# Altium project Universal_Analog_Input.PrjPcb (part 2 of 2)

## Sheet [03] - Power.SchDoc
size A2; DocumentNumber: 5; SheetNumber: 5; SheetTotal: 5
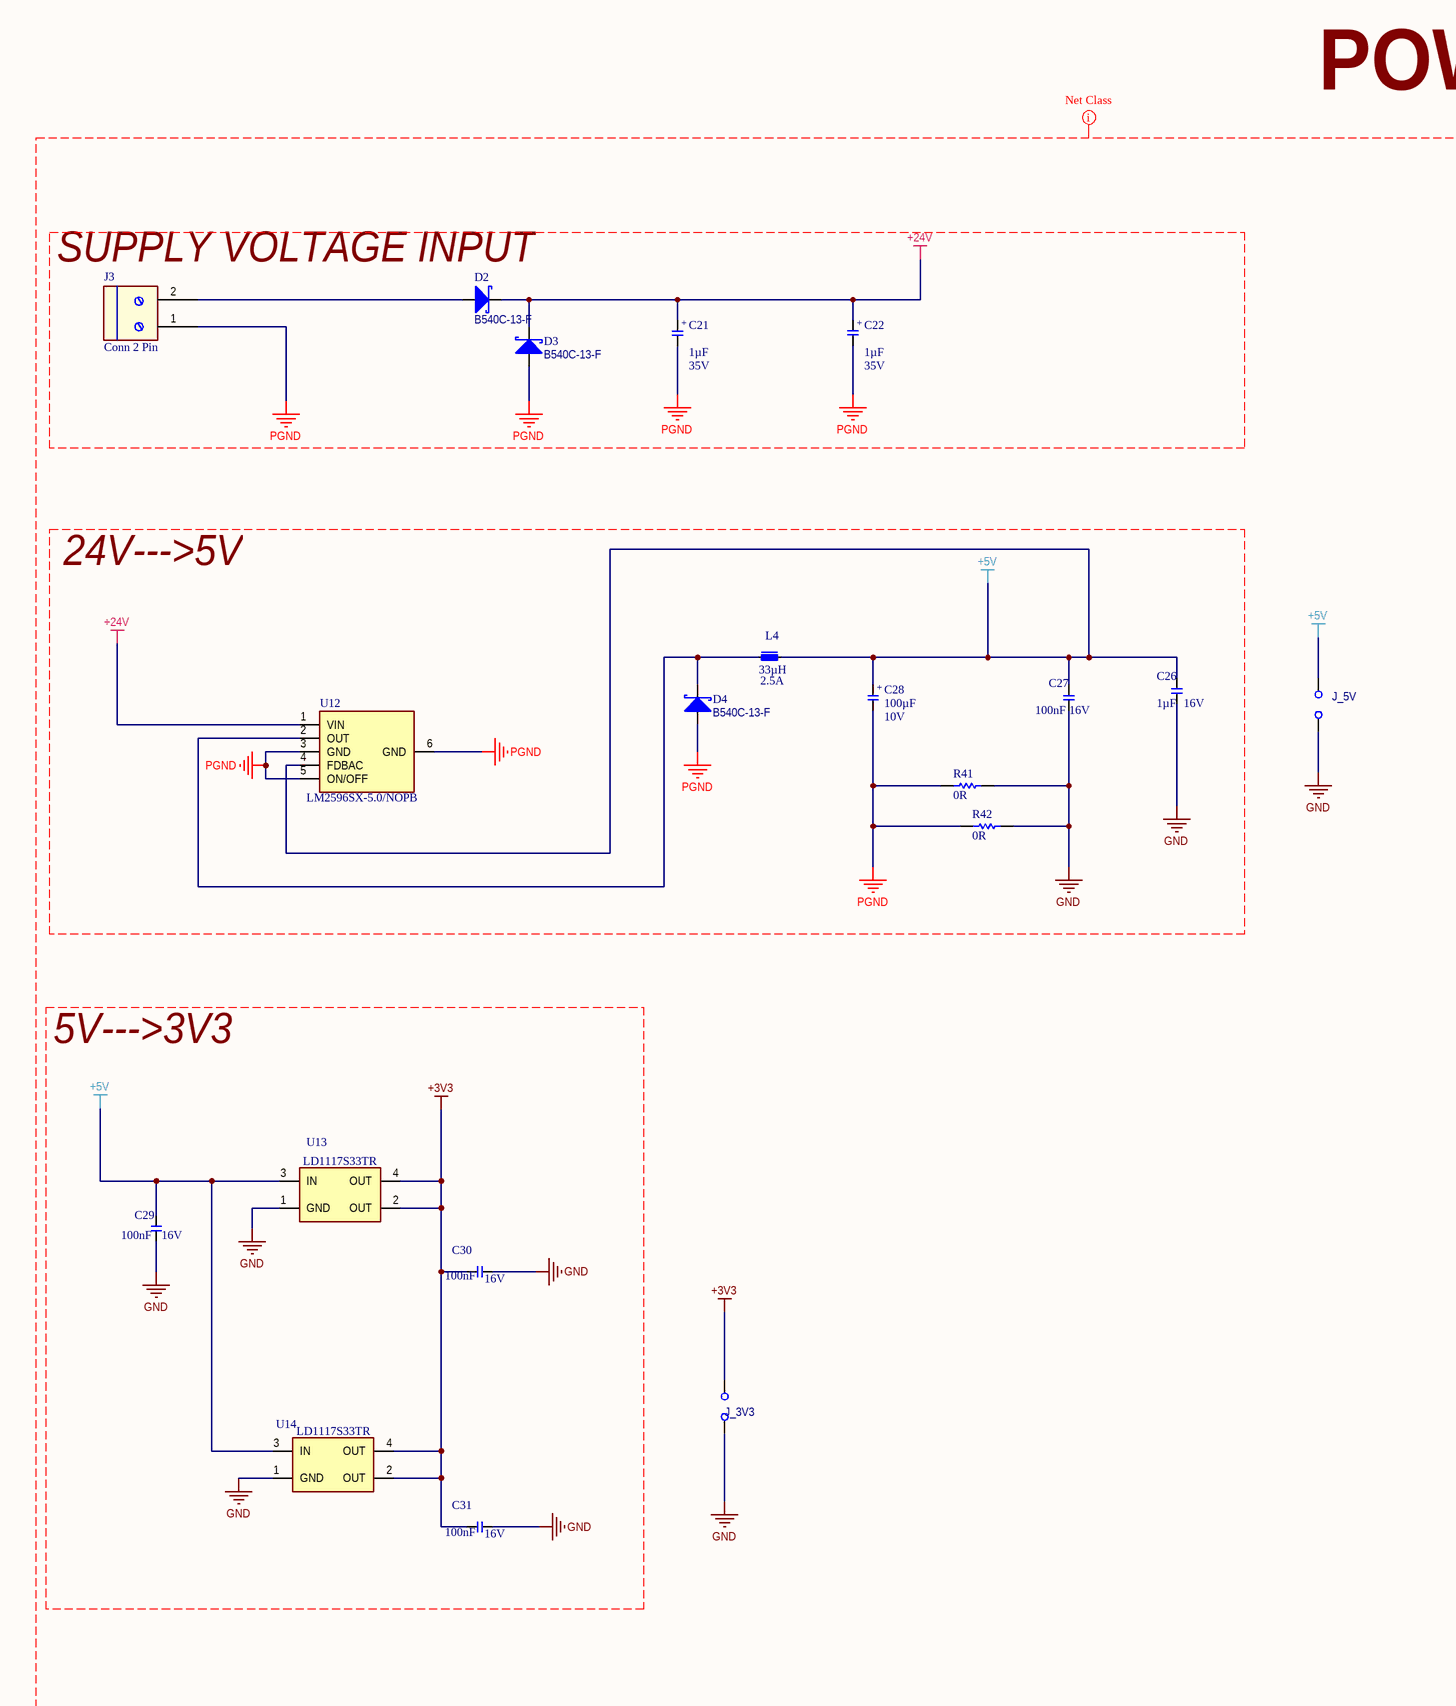
[diagram p6: [03] - Power.SchDoc, left]
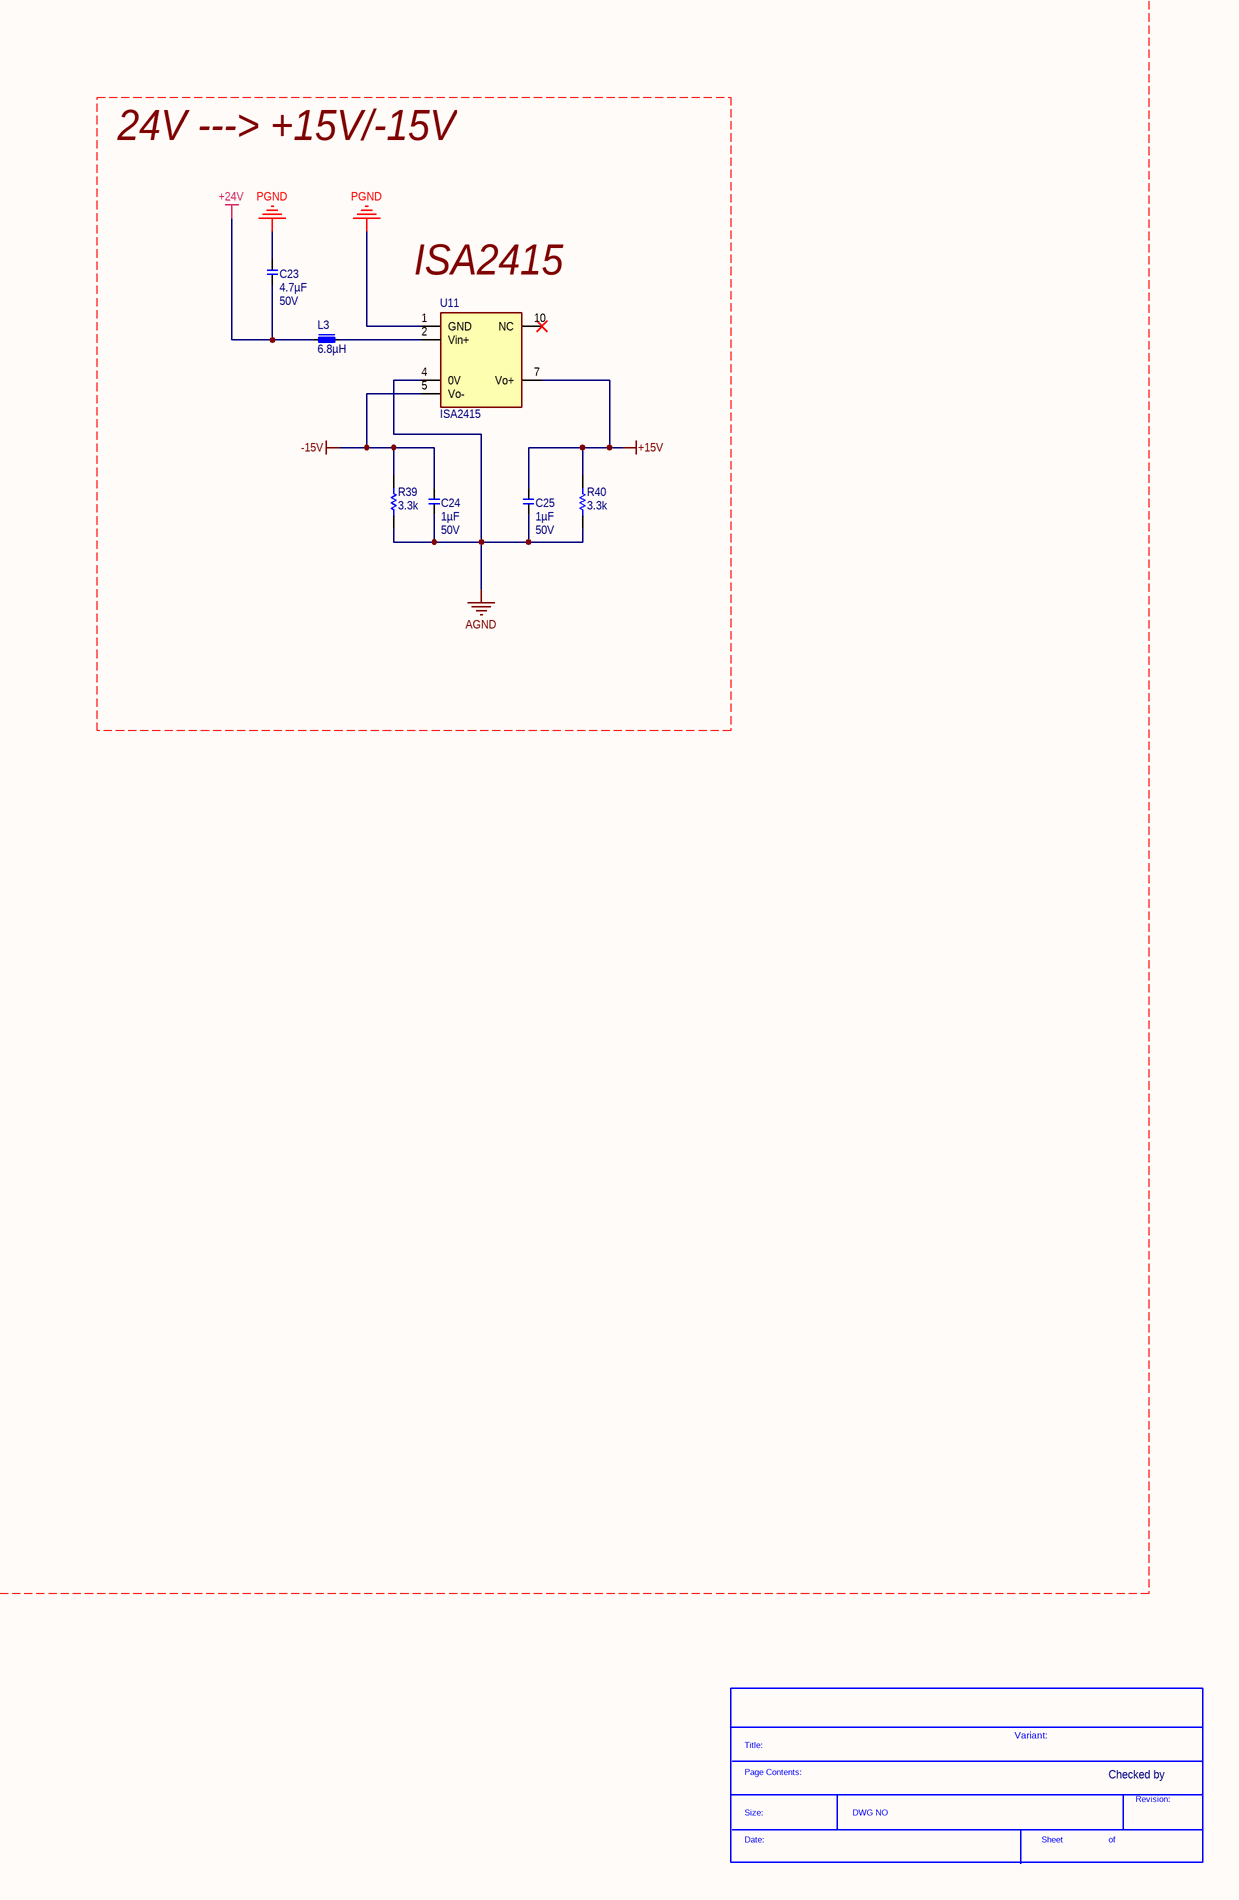
[diagram p7: [03] - Power.SchDoc, right]

### Parts
(Parts that share a designator on the sheet are numbered #1, #2 ... from top to bottom, then left to right.)
*?#3  SDTitleBlock  (value not drawn)  (graphical)
C21  Capacitance: 1µF  Voltage - Rated: 35V  [Case_A]  (hidden comment: CAP TANT 1UF 35V 10% 1206)
C22  Capacitance: 1µF  Voltage - Rated: 35V  [Case_A]  (hidden comment: CAP TANT 1UF 35V 10% 1206)
C23  Capacitance: 4.7µF  Voltage - Rated: 50V  [C1206]  (hidden comment: 4.7UF 50V X7R)
C24  Capacitance: 1µF  Voltage - Rated: 50V  [C0805]  (hidden comment: 1UF 50V X7R)
C25  Capacitance: 1µF  Voltage - Rated: 50V  [C0805]  (hidden comment: 1UF 50V X7R)
C26  1µF  Voltage - Rated: 16V  [C0805]
C27  100nF  Voltage - Rated: 16V  [C0805]
C28  Voltage - Rated: 10V  [Case_C]  (hidden comment: 100µF)
C29  100nF  Voltage - Rated: 16V  [C0805]
C30  100nF  Voltage - Rated: 16V  [C0805]
C31  100nF  Voltage - Rated: 16V  [C0805]
D2  B540C-13-F  [B520C-13-F]
D3  B540C-13-F  [B520C-13-F]
D4  B540C-13-F  [B520C-13-F]
J3  Conn 2 Pin  [Connector 2 Ways Pitch 3,81]
J_3V3  PH1-02-TA-HT  [HDR1X2V]  (value not drawn)
J_5V  PH1-02-TA-HT  [HDR1X2V]  (value not drawn)
L3  Inductance: 6.8µH  [0805]  (hidden comment: 6.8UH 550MA)
L4  Inductance: 33µH  Current Rating: 2.5A  [Bobin_SMD]  (hidden comment: L-IND 33UH 2.5A)
R39  Resistance (Ohms): 3.3k  [R0805]  (hidden comment: 3.3K OHM 0805)
R40  Resistance (Ohms): 3.3k  [R0805]  (hidden comment: 3.3K OHM 0805)
R41  0R  [R0805]
R42  0R  [R0805]
U11  DC/DC CONV  [ISA2415]  (value not drawn)
U12  Manufacturer Part Number: LM2596SX-5.0/NOPB  [TO-263-5]  (hidden comment: IC-LM2596SX-5.0/NOPB)
U13  Manufacturer Part Number: LD1117S33TR  [SOT-223_L]  (hidden comment: IC-LD1117S33TR)
U14  Manufacturer Part Number: LD1117S33TR  [SOT-223_L]  (hidden comment: IC-LD1117S33TR)

### Nets
+3V3: C30.2 C31.2 J_3V3.2 U13.2(OUT) U13.4(OUT) U14.2(OUT) U14.4(OUT)
+5V: C26.2 C27.2 C28.1 C29.2 J_5V.2 L4.2 U12.4(FDBAC) U13.3(IN) U14.3(IN)
+15V: C25.2 R40.2 U11.7(Vo+)
+24V: C21.1 C22.1 C23.1 D2.1 D3.1 L3.1 U12.1(VIN)
-15V: C24.2 R39.2 U11.5(Vo-)
AGND: C24.1 C25.1 R39.1 R40.1 U11.4(0V)
GND: C26.1 C27.1 C29.1 C30.1 C31.1 J_3V3.1 J_5V.1 R41.2 R42.2 U13.1(GND) U14.1(GND)
PGND: C21.2 C22.2 C23.2 C28.2 D3.2 D4.2 J3.1 R41.1 R42.1 U11.1(GND) U12.3(GND) U12.5(ON/OFF) U12.6(GND)
NetD2_2: D2.2 J3.2
NetD4_1: D4.1 L4.1 U12.2(OUT)
NetL3_2: L3.2 U11.2(Vin+)

Not connected (* = marked no-connect by the designer): U11 10(NC)*

### Layout directives
net class POWER: +3V3, +5V, +15V, +24V, -15V, AGND, GND, PGND

### Notes on the sheet
- POWER
- SUPPLY VOLTAGE INPUT
- 24V ---> +15V/-15V
- (near U11) ISA2415
- 24V--->5V
- 5V--->3V3
- Variant:
- Checked by
- (in symbol C-10UF,TANTAL C) +
- (in symbol C-T491A105K035AT) +
- (in symbol SDTitleBlock) Title:; Page Contents:; Revision:; Size:; DWG NO; Date:; Sheet; of

### Library data of the parts
C21 C22 = C-T491A105K035AT: Manufacturer: Kemet; Manufacturer Size Code: A; ESR (Equivalent Series Resistance): 7 Ohm; Type: Molded; Lifetime @ Temp.: 2000 Hrs @ 85°C; Supplier 1: Digi-Key; Manufacturer Part Number: T491A105K035AT; RoHS: RoHS Compliant; Pricing 1: 1=0.4, 10=0.354, 50=0.2146, 100=0.1768, 250=0.1414, 500=0.12878, 1000=0.11615 (USD); ComponentLink1URL: http://www.kemet.com/Lists/ProductCatalog/Attachments/254/KEM_T2005_T491.pdf; ComponentLink1Description: http://www.kemet.com/Lists/ProductCatalog/Attachments/254/KEM_T2005_T491.pdf; Category: Capacitors; Stock 1: 10565; Packaging: Cut Tape (CT); Tolerance: ±10%; Operating Temperature: -55°C ~ 125°C; Mounting Type: Surface Mount; Package / Case: 1206 (3216 Metric); Size / Dimension: 0.126" L x 0.063" W (3.20mm x 1.60mm); Height - Seated (Max): 0.071" (1.80mm); Lead Spacing: -; Features: General Purpose
C23 = C-4.7UF,50V,1206: CAP CER 4.7UF 50V X7R 1206; Manufacturer: Samsung Electro-Mechanics America, Inc.; Manufacturer Part Number: CL31B475KBHNNNE; Tolerance: ±10%; Supplier 1: Digi-Key; RoHS: RoHS Compliant; Category: Capacitors; Stock 1: 128633; Pricing 1: 1=0.34, 10=0.28, 25=0.1928, 50=0.1576, 100=0.1401, 500=0.0928, 1000=0.0823 (USD); Packaging: Digi-Reel®; Temperature Coefficient: X7R; Mounting Type: Surface Mount, MLCC; Operating Temperature: -55°C ~ 125°C; Applications: General Purpose; Ratings: -; Package / Case: 1206 (3216 Metric); Size / Dimension: 0.126" L x 0.063" W (3.20mm x 1.60mm); Height - Seated (Max): -; Thickness (Max): 0.071" (1.80mm); Lead Spacing: -; Features: -; Lead Style: -; ComponentLink1URL: http://www.samsungsem.com/kr/support/product-search/mlcc/CL31B475KBHNNNE.jsp; ComponentLink1Description: http://www.samsungsem.com/kr/support/product-search/mlcc/CL31B475KBHNNNE.jsp; Supplier Part Number 1: 1276-2789-6-ND
C24 C25 = C-1UF,50V: CAP CER 1UF 50V X7R 0805; Manufacturer: Samsung Electro-Mechanics America, Inc.; Manufacturer Part Number: CL21B105KBFNNNE; Tolerance: ±10%; Supplier 1: Digi-Key; RoHS: RoHS Compliant; Category: Capacitors; Stock 1: 162738; Pricing 1: 1=0.21, 10=0.143, 25=0.104, 50=0.0866, 100=0.0727, 500=0.05194, 1000=0.04414 (USD); Packaging: Digi-Reel®; Temperature Coefficient: X7R; Mounting Type: Surface Mount, MLCC; Operating Temperature: -55°C ~ 125°C; Applications: General Purpose; Ratings: -; Package / Case: 0805 (2012 Metric); Size / Dimension: 0.079" L x 0.049" W (2.00mm x 1.25mm); Height - Seated (Max): -; Thickness (Max): 0.053" (1.35mm); Lead Spacing: -; Features: -; Lead Style: -; ComponentLink1URL: http://www.samsungsem.com/kr/support/product-search/mlcc/CL21B105KBFNNNE.jsp; ComponentLink1Description: http://www.samsungsem.com/kr/support/product-search/mlcc/CL21B105KBFNNNE.jsp; Supplier Part Number 1: 1276-1029-6-ND
C26 = C-1UF,16V,0805: AVX - 0805YC105KAT2A - CAP, MLCC, X7R, 1UF, 16V, 0805; Manufacturer: AVX Corporation; Tolerance: ±10%; Supplier 1: Digi-Key; Manufacturer Part Number: 0805YC105KAT2A; RoHS: RoHS Compliant; Stock 1: 76930; Pricing 1: 1=0.19, 10=0.132, 25=0.0964, 50=0.075, 100=0.0622, 250=0.05148, 500=0.04362, 1000=0.03611 (USD); Capacitance: 1µF; Packaging: Cut Tape (CT); ComponentLink1URL: http://datasheets.avx.com/X7RDielectric.pdf; ComponentLink1Description: http://datasheets.avx.com/X7RDielectric.pdf; Supplier Part Number 1: 478-5034-1-ND; Category: Capacitors; Temperature Coefficient: X7R; Mounting Type: Surface Mount, MLCC; Operating Temperature: -55°C ~ 125°C; Applications: General Purpose; Ratings: -; Package / Case: 0805 (2012 Metric); Size / Dimension: 0.079" L x 0.049" W (2.01mm x 1.25mm); Height - Seated (Max): -; Thickness (Max): 0.055" (1.40mm); Lead Spacing: -; Features: -; Lead Style: -
C27 C29-C31 = C-100NF,16V,0805: AVX - 0805YA103JAT2A - CAP, MLCC, C0G/NP0, 10NF, 16V, 0805; Tolerance: ±5%; Temperature Coefficient: C0G, NP0; Supplier 1: Digi-Key; Manufacturer: AVX; Manufacturer Part Number: 0805YA103JAT2A; RoHS: YES; Stock 1: 28062; Pricing 1: 1=0.29, 10=0.204, 25=0.1668, 50=0.1424, 100=0.1221, 250=0.10176, 500=0.09158, 1000=0.07733 (USD); Capacitance: 100nF; Packaging: Cut Tape (CT); ComponentLink1URL: http://www.avx.com/docs/Catalogs/ccog.pdf; ComponentLink1Description: http://www.avx.com/docs/Catalogs/ccog.pdf; Supplier Part Number 1: 478-1334-1-ND; ComponentLink2URL: http://www.farnell.com/datasheets/1825494.pdf; ComponentLink2Description: http://www.farnell.com/datasheets/1825494.pdf; Category: Capacitors; Mounting Type: Surface Mount, MLCC; Operating Temperature: -55°C ~ 125°C; Applications: General Purpose; Ratings: -; Package / Case: 0805 (2012 Metric); Size / Dimension: 0.079" L x 0.049" W (2.01mm x 1.25mm); Height - Seated (Max): -; Thickness (Max): 0.037" (0.94mm); Lead Spacing: -; Features: -; Lead Style: -; ComponentLink3URL: http://datasheets.avx.com/C0GNP0-Dielectric.pdf; ComponentLink3Description: http://datasheets.avx.com/C0GNP0-Dielectric.pdf
C28 = C-10UF,TANTAL C: CAP TANT 100UF 10V 10% 2413; Manufacturer: Kemet; Manufacturer Part Number: T491C107K010AT; Manufacturer Size Code: C; ESR (Equivalent Series Resistance): 1.2 Ohm; Type: Molded; Lifetime @ Temp.: 2000 Hrs @ 85°C; Supplier 1: Digi-Key; RoHS: RoHS Compliant; Category: Capacitors; Stock 1: 1879; Pricing 1: 1=2.2, 10=1.804, 50=1.584, 100=1.276, 250=1.056 (USD); Packaging: Cut Tape (CT); Tolerance: ±10%; Operating Temperature: -55°C ~ 125°C; Mounting Type: Surface Mount; Package / Case: 2413 (6032 Metric); Size / Dimension: 0.236" L x 0.126" W (6.00mm x 3.20mm); Height - Seated (Max): 0.110" (2.80mm); Lead Spacing: -; Features: General Purpose; ComponentLink1URL: http://www.kemet.com/Lists/ProductCatalog/Attachments/254/KEM_T2005_T491.pdf; ComponentLink1Description: http://www.kemet.com/Lists/ProductCatalog/Attachments/254/KEM_T2005_T491.pdf; Supplier Part Number 1: 399-8338-1-ND; Capacitance: 100µF
D2-D4 = D-B540C-13-F SCHOTTKY 40V 5A SMC: DIODE SCHOTTKY 40V 5A SMC; Manufacturer: Diodes Incorporated; Voltage - Forward (Vf) (Max) @ If: 550mV @ 5A; Speed: Fast Recovery =< 500ns, > 200mA (Io); Current - Reverse Leakage @ Vr: 500µA @ 40V; Capacitance @ Vr, F: 300pF @ 4V, 1MHz; Diode Configuration: 1 Pair Series Connection; Current - Average Rectified (Io) (per Diode): 215mA (DC); Supplier 1: Digi-Key; Supplier Part Number 1: B540C-FDICT-ND; RoHS: RoHS Compliant; Category: Discrete Semiconductor Products; Stock 1: 21029; Pricing 1: 1=0.5, 10=0.426, 100=0.3179, 500=0.2497, 1000=0.1925 (USD); Packaging: Cut Tape (CT); Diode Type: Schottky; Voltage - DC Reverse (Vr) (Max): 40V; Current - Average Rectified (Io): 5A; Reverse Recovery Time (trr): -; Mounting Type: Surface Mount; Package / Case: DO-214AB, SMC; Supplier Device Package: SMC; Operating Temperature - Junction: -55°C ~ 125°C; ComponentLink1URL: http://www.diodes.com/_files/datasheets/ds13012.pdf; ComponentLink1Description: http://www.diodes.com/_files/datasheets/ds13012.pdf; Supplier 2: Digi-Key; Stock 2: 58594; Pricing 2: 1=0.13, 10=0.115, 100=0.0626, 500=0.0385, 1000=0.02627 (USD); ComponentLink2URL: http://www.nxp.com/documents/data_sheet/BAV99_SER.pdf; ComponentLink2Description: http://www.nxp.com/documents/data_sheet/BAV99_SER.pdf; Manufacturer Part Number: B540C-13-F; Supplier Part Number 2: 568-5005-1-ND
J3 = Conn 2 Pin 3.81mm: TERM BLOCK HDR 2POS R/A 3.81MM; Manufacturer: Phoenix Contact; Manufacturer Part Number: 1803277; Number of Positions: 2; Number of Levels: 1; Pitch: 0.150" (3.81mm); Header Orientation: 90°, Right Angle; Current - IEC: 8A; Voltage - IEC: 250V; Voltage - UL: 300V; Supplier 1: Digi-Key; RoHS: RoHS Compliant; Category: Connectors, Interconnects; Stock 1: 4266; Pricing 1: 1=0.75, 10=0.716, 50=0.6844, 100=0.6658, 250=0.6222, 500=0.57242, 1000=0.5185, 2500=0.4941, 5000=0.4636 (USD); Packaging: Bulk; Type: Header, Male Pins, Shrouded (4 Side); Positions Per Level: 2; Plug Wire Entry: -; Termination Style: Solder; Mounting Type: Through Hole; Current - UL: 8A; Wire Gauge or Range - AWG: -; Wire Gauge or Range - mm²: -; Color: Green; Operating Temperature: -; Contact Mating Finish: Tin; Features: -; ComponentLink1URL: http://media.digikey.com/pdf/Data%20Sheets/Phoenix%20Contact%20PDFs/1803277.pdf; ComponentLink1Description: http://media.digikey.com/pdf/Data%20Sheets/Phoenix%20Contact%20PDFs/1803277.pdf; Supplier Part Number 1: 277-1206-ND
J_3V3 J_5V = Jumper: 2 Pos. 2.54 mm Single Row Through Hole Straight Pin Header; Manufacturer: ADAM TECH; Distributor: Future; Price: 0.02 Euro; PartNum: PH1-02-TA-HT; PartName: PH1-02-TA-HT; Price50: 0.02 Euro; Price100: 0.02 Euro; Price1000: 0.02 Euro
L3 = L-6.8UH,550mA,0805: FIXED IND 6.8UH 550MA 250 MOHM; Manufacturer: TDK Corporation; Manufacturer Part Number: MLZ2012N6R8LT000; Type: Multilayer; Material - Core: Ferrite; Tolerance: ±20%; Current - Saturation: 110mA; Shielding: Shielded; Frequency - Self Resonant: 60MHz; Frequency - Test: 2MHz; Supplier 1: Digi-Key; RoHS: RoHS Compliant; Category: Inductors, Coils, Chokes; Stock 1: 11951; Pricing 1: 1=0.14, 10=0.125, 50=0.0976, 100=0.0875, 500=0.075, 1000=0.065 (USD); Packaging: Digi-Reel®; Part Status: Active; Current Rating: 550mA; DC Resistance (DCR): 250 mOhm; Q @ Freq: -; Ratings: -; Operating Temperature: -55°C ~ 125°C; Mounting Type: Surface Mount; Package / Case: 0805 (2012 Metric); Size / Dimension: 0.079" L x 0.049" W (2.00mm x 1.25mm); Height - Seated (Max): 0.057" (1.45mm); ComponentLink1URL: https://product.tdk.com/info/en/catalog/datasheets/inductor_commercial_decoupling_mlz2012_en.pdf; ComponentLink1Description: https://product.tdk.com/info/en/catalog/datasheets/inductor_commercial_decoupling_mlz2012_en.pdf; Supplier Part Number 1: 445-6761-6-ND
L4 = L-IND 33UH 2.5A: FIXED IND 33UH 2.5A 79 MOHM SMD; Manufacturer: Wurth Electronics Inc; Manufacturer Part Number: 7447714330; Type: Wirewound; Material - Core: Ferrite; Tolerance: ±20%; Current - Saturation: 2.9A; Shielding: Shielded; DC Resistance (DCR): 79 mOhm Max; Frequency - Self Resonant: 11.1MHz; Frequency - Test: 100kHz; Supplier 1: Digi-Key; RoHS: RoHS Compliant; Category: Inductors, Coils, Chokes; Stock 1: 137; Pricing 1: 1=2.76, 10=2.415, 50=2.2424, 100=2.1562, 250=2.07 (USD); Packaging: Cut Tape (CT); Q @ Freq: -; Ratings: -; Operating Temperature: -40°C ~ 125°C; Mounting Type: Surface Mount; Package / Case: Nonstandard; Size / Dimension: 0.394" L x 0.394" W (10.00mm x 10.00mm); Height - Seated (Max): 0.197" (5.00mm); ComponentLink1URL: http://katalog.we-online.de/pbs/datasheet/7447714330.pdf; ComponentLink1Description: http://katalog.we-online.de/pbs/datasheet/7447714330.pdf; Supplier Part Number 1: 732-2993-1-ND
R39 R40 = R-3.3K,0805: RES SMD 3.3K OHM 5% 1/8W 0805; Manufacturer: Yageo; Manufacturer Part Number: RC0805JR-073K3L; Power (Watts): 0.125W, 1/8W; Temperature Coefficient: ±100ppm/°C; Supplier 1: Digi-Key; RoHS: RoHS Compliant; Category: Resistors; Stock 1: 439567; Pricing 1: 1=0.1, 10=0.018, 25=0.0128, 100=0.0073, 250=0.00556, 500=0.00444, 1000=0.00326, 2500=0.00283 (USD); Packaging: Digi-Reel®; Tolerance: ±5%; Composition: Thick Film; Features: Moisture Resistant; Operating Temperature: -55°C ~ 155°C; Package / Case: 0805 (2012 Metric); Supplier Device Package: 0805; Size / Dimension: 0.079" L x 0.049" W (2.00mm x 1.25mm); Height: 0.024" (0.60mm); Number of Terminations: 2; ComponentLink1URL: http://www.yageo.com/documents/recent/PYu-RC_Group_51_RoHS_L_04.pdf; ComponentLink1Description: http://www.yageo.com/documents/recent/PYu-RC_Group_51_RoHS_L_04.pdf; Supplier Part Number 1: 311-3.3KARDKR-ND
R41 R42 = R-0R,0805: BOURNS - CR0805-J/-000ELF - RESISTOR, 0805, 0R, 5%, 1/8W; Product Range: BOURNS - CR Series; Power Rating: 125; Resistor Case Style: 0805 [2012 Metric]; Resistor Element Material: Thick Film; Temperature Coefficient: -250ppm/°C to +500; Voltage Rating: 150; SVHC: No SVHC (16-Jun-2014); Resistor Mounting: SMD<!--FANDB--><div class="features-and-benefits-container"></div>; Supplier 1: Farnell; Manufacturer: BOURNS; Manufacturer Part Number: CR0805-J/-000ELF; RoHS: YES; Stock 1: 20931; Pricing 1: 50=0,0234, 250=0,0208, 1000=0,0182, 5000=0,0143, 10000=0,0104 (EUR); Resistance Tolerance: ± 5%; Packaging: Cut Tape; MSL: MSL 1 - Unlimited; ComponentLink1URL: http://www.farnell.com/datasheets/1845293.pdf; ComponentLink1Description: http://www.farnell.com/datasheets/1845293.pdf; Supplier Part Number 1: 2008388RL; Supplier 2: Farnell; Supplier 3: Newark; Supplier Part Number 3: 66F5622; Resistance: 0R
U11 = IC-ISA2415: DC/DC CONV 1W SMD DUAL OUT; Manufacturer: XP Power; Number of Outputs: 2; Voltage - Input (Min): 21.6V; Voltage - Input (Max): 26.4V; Voltage - Output 1: 15V; Voltage - Output 2: -15V; Current - Output (Max): 33mA, 33mA; Voltage - Isolation: 1.5kV (1500V); Efficiency: 82%; Supplier 1: Digi-Key; RoHS: RoHS Compliant; Category: Power Supplies - Board Mount; Stock 1: 223; Pricing 1: 1=4.75, 5=4.61, 10=4.47, 25=4.28, 100=3.99, 500=3.71002 (USD); Packaging: Tube; Type: Isolated Module; Voltage - Output 3: -; Power (Watts) - Manufacture Series: 1W; Applications: ITE (Commercial); Features: SCP; Mounting Type: Surface Mount; Package / Case: 10-SMD Module (6 Leads); Size / Dimension: 0.60" L x 0.33" W x 0.29" H (15.2mm x 8.3mm x 7.3mm); Operating Temperature: -40°C ~ 105°C; Power (Watts) - Max: 1W; ComponentLink1URL: http://www.xppower.com/Portals/0/pdfs/SF_ISA.pdf; ComponentLink1Description: http://www.xppower.com/Portals/0/pdfs/SF_ISA.pdf; Supplier Part Number 1: 1470-2970-5-ND; Manufacturer Part Number: ISA2415
U12 = IC-LM2596SX-5.0/NOPB: Voltage Regulators - Switching Regulators 150 KHZ 3A STEP-DOWN VLTG REG; Manufacturer: Texas Instruments; Input Voltage MAX: 40 V; Number of Outputs: 1 Output; Output Voltage: 5 V; Switching Frequency: 173 kHz; Topology: Buck; Input Voltage MIN: 4.5 V; Supplier 1: Mouser; RoHS: RoHS Compliant; Category: Voltage Regulators - Switching Regulators; Stock 1: 1902; Pricing 1: 1=4.45, 10=3.98, 25=3.57, 50=3.42, 100=3.26, 250=2.94, 500=2.64, 1000=2.39, 1500=2.03 (USD); Operating Temperature Range: - 40 C to + 85 C; Output Current: 3 A; Package/Case: TO-263-5; Packaging: Reel; Series: LM2596; Type: Inverting, Step Down; Brand: Texas Instruments; Mounting Style: SMD/SMT; Maximum Operating Temperature: + 125 C; Minimum Operating Temperature: - 40 C; Standard Pack Qty: 500; RoHS - Mouser: Y; Minimum Order Quantity: 1; Reeling: True; ComponentLink1URL: http://www.mouser.com/ds/2/405/snvs124c-317006.pdf; ComponentLink1Description: http://www.mouser.com/ds/2/405/snvs124c-317006.pdf; Supplier Part Number 1: 926-LM2596SX-5.0NOPB
U13 U14 = IC-LD1117S33TR: IC REG LDO 3.3V 0.8A SOT223; Manufacturer: STMicroelectronics; Regulator Topology: Positive Fixed; Current - Output: 800mA; Voltage - Dropout (Typical): 1.1V @ 800mA; Number of Regulators: 1; Voltage - Input: Up to 15V; Supplier 1: Digi-Key; RoHS: RoHS Compliant; Stock 1: 5854; Pricing 1: 1=0.46, 10=0.373, 100=0.2541, 500=0.1902, 1000=0.14245 (USD); ComponentLink1URL: http://www.st.com/web/en/resource/technical/document/datasheet/CD00000544.pdf; ComponentLink1Description: http://www.st.com/web/en/resource/technical/document/datasheet/CD00000544.pdf; Supplier Part Number 1: 497-1242-1-ND; Category: Integrated Circuits (ICs); Packaging: Cut Tape (CT); Voltage - Output: 3.3V; Current - Limit (Min): -; Operating Temperature: 0°C ~ 125°C; Mounting Type: Surface Mount; Package / Case: TO-261-4, TO-261AA; Supplier Device Package: SOT-223

## Nets that join several sheets
+3V3: [01] - AFE (TP7.1 U4.1), [02] - STM32F1 (10 pins), [03] - Power (7 pins)
+5V: [01] - AFE (L1.2), [03] - Power (9 pins)
+15V: [01] - AFE (U5.16), [03] - Power (C25.2 R40.2 U11.7)
-15V: [01] - AFE (U5.5), [03] - Power (C24.2 R39.2 U11.5)
AGND: [01] - AFE (32 pins), [03] - Power (5 pins)
GND: [01] - AFE (14 pins), [02] - STM32F1 (15 pins), [03] - Power (11 pins)
NetR1_2: [01] - AFE (R1.2), [02] - STM32F1 (U15.28)
NetR2_2: [01] - AFE (R2.2), [02] - STM32F1 (U15.27)
NetR3_2: [01] - AFE (R3.2), [02] - STM32F1 (U15.26)
NetR4_2: [01] - AFE (R4.2), [02] - STM32F1 (U15.25)
NetR16_1: [01] - AFE (R16.1 TP8.1), [02] - STM32F1 (U15.29)
NetR27_1: [01] - AFE (R27.1 TP12.1), [02] - STM32F1 (U15.32)
NetR28_1: [01] - AFE (R28.1 TP11.1), [02] - STM32F1 (U15.30)
NetR37_1: [01] - AFE (R37.1 TP13.1), [02] - STM32F1 (U15.31)
NetU4_3: [01] - AFE (U4.3), [02] - STM32F1 (U15.38)
SPI1_MISO: [01] - AFE (U4.6), [02] - STM32F1 (U15.40)
SPI1_MOSI: [01] - AFE (U4.5), [02] - STM32F1 (U15.41)
SPI1_SCK: [01] - AFE (U4.4), [02] - STM32F1 (U15.39)